# EAGLE design SPI_Switch (EAGLE 6.5.0)
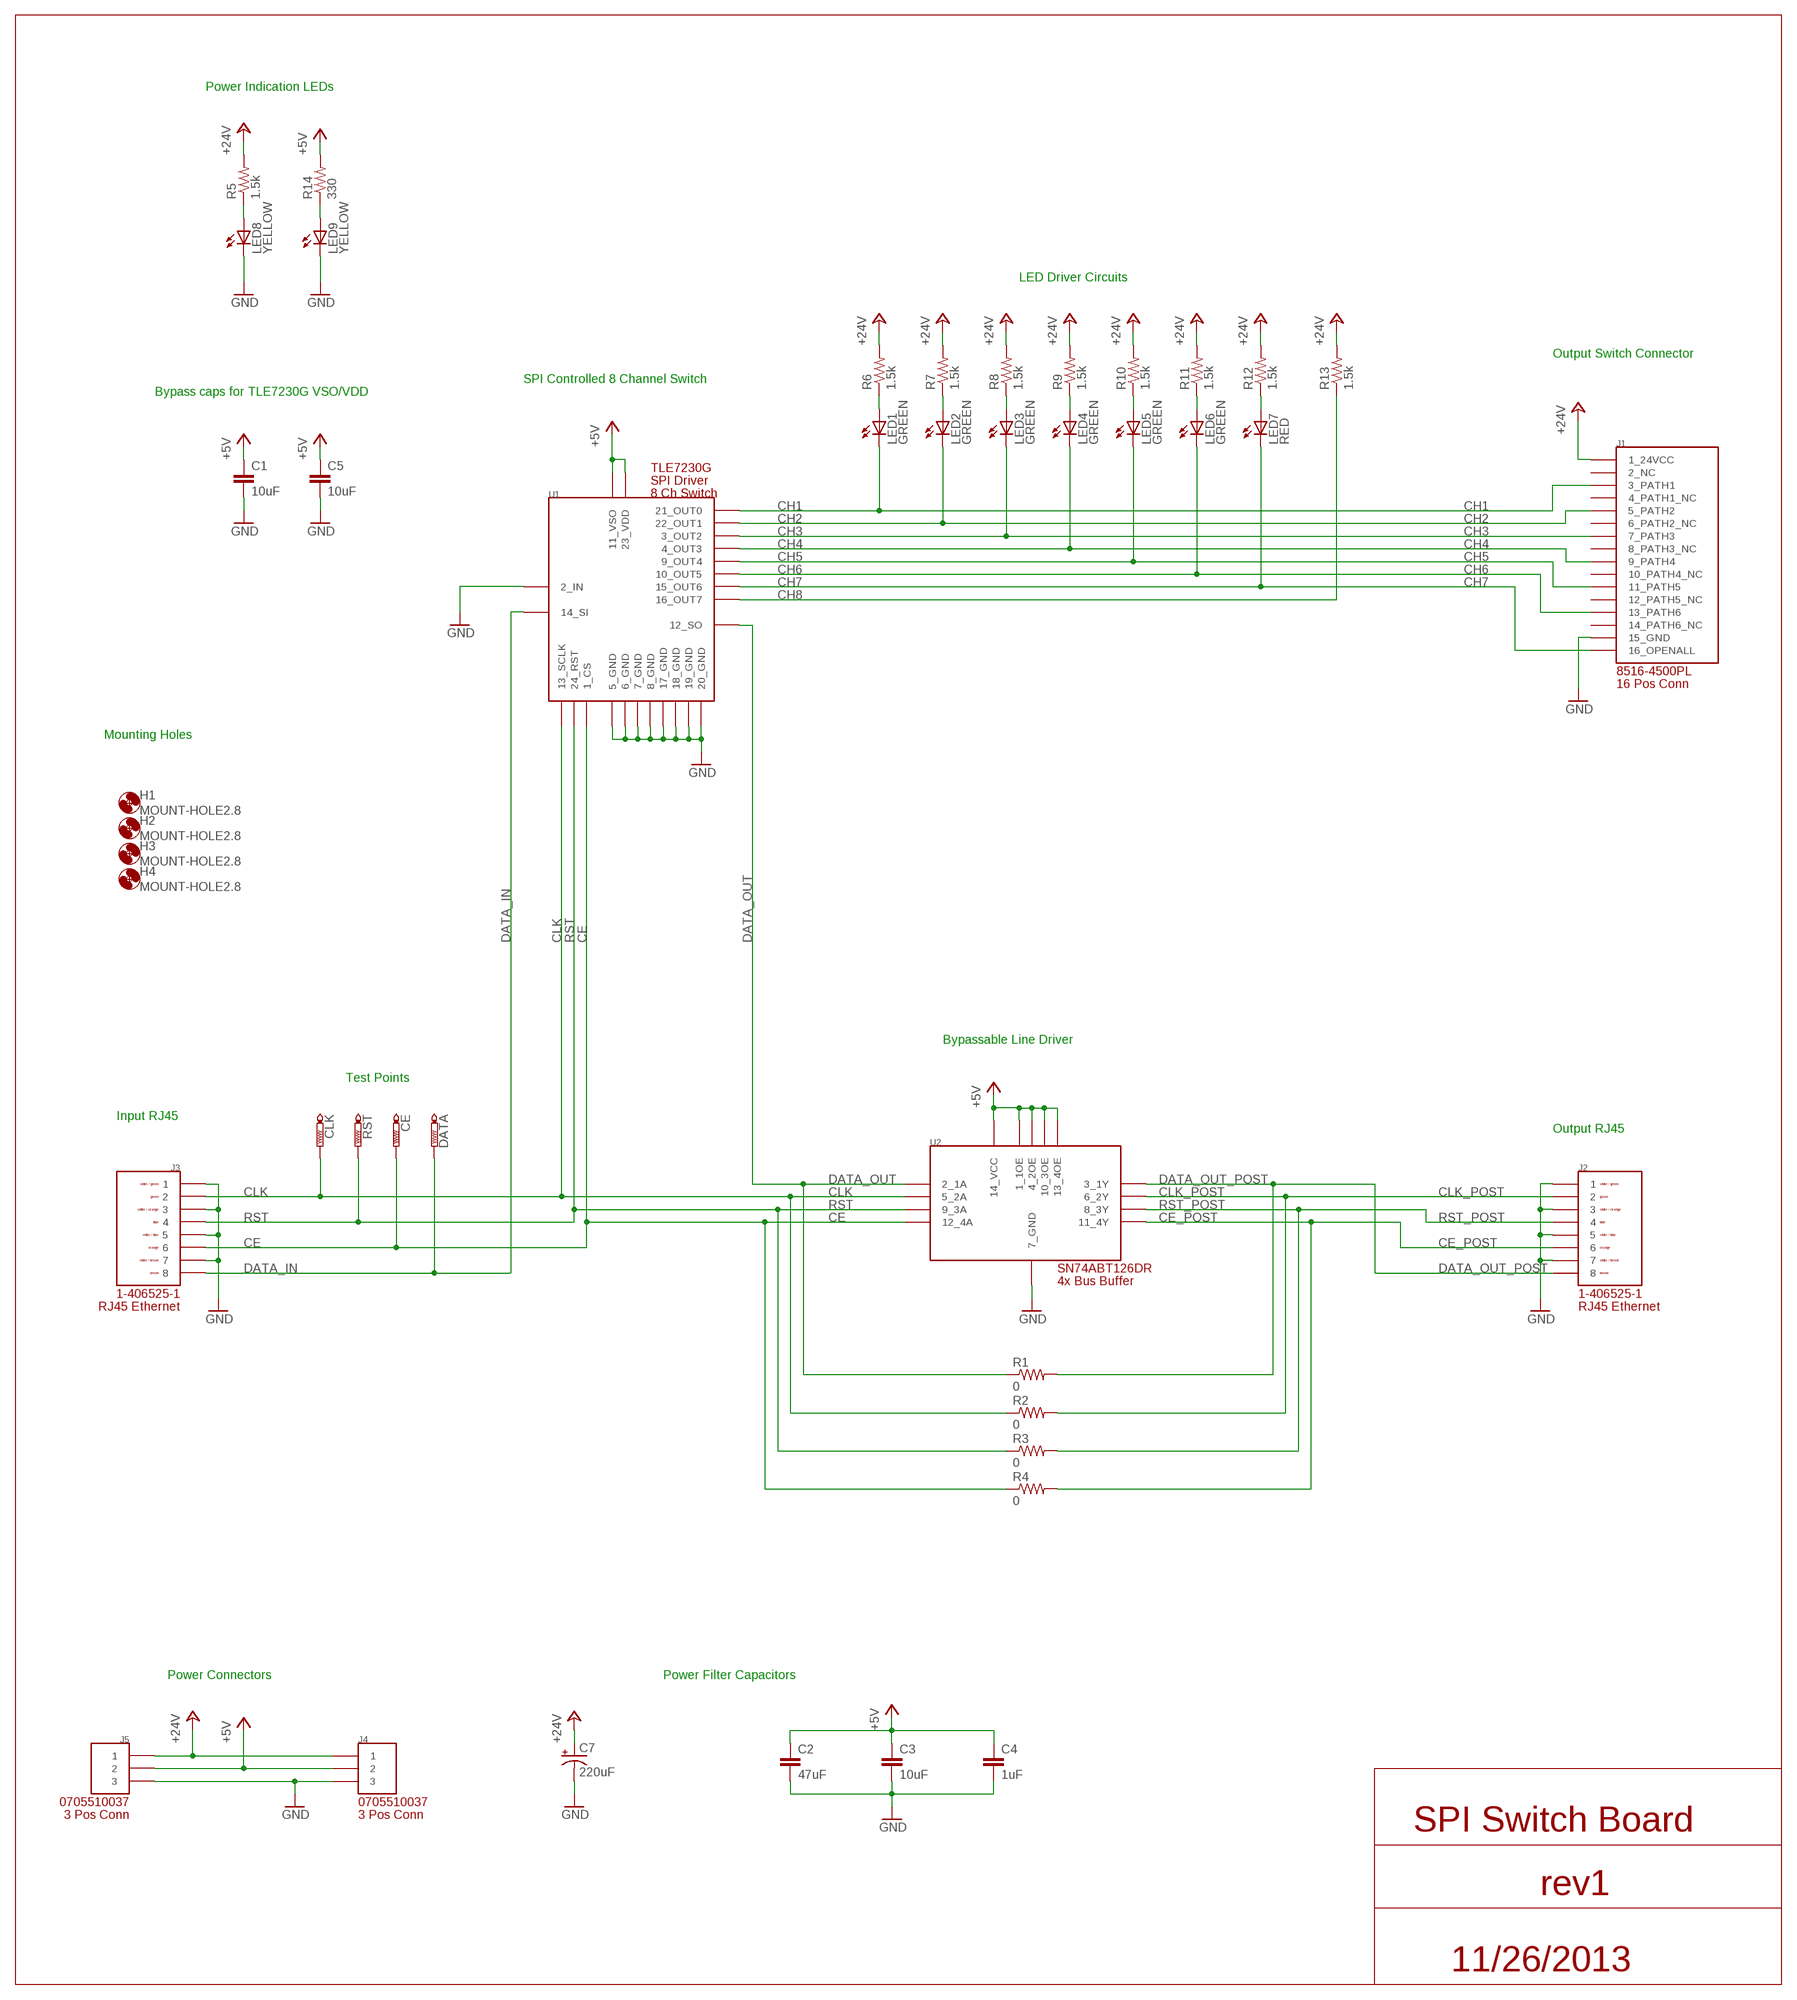
[diagram p0: schematic, sheet 1]

## Parts
C1  10uF  CAP0805  [0805]
C2  47uF  CAP0805  [0805]
C3  10uF  CAP0805  [0805]
C4  1uF  CAP0805  [0805]
C5  10uF  CAP0805  [0805]
C7  220uF  CAP_POLE  [PANASONIC_E]
CE  PTR1PAD1-13  [P1-13]
CLK  PTR1PAD1-13  [P1-13]
DATA  PTR1PAD1-13  [P1-13]
H1  MOUNT-HOLE2.8  [2,8]
H2  MOUNT-HOLE2.8  [2,8]
H3  MOUNT-HOLE2.8  [2,8]
H4  MOUNT-HOLE2.8  [2,8]
J1  8516-4500PL  [8516-4500PL]
J2  1-406525-1  [1-406525-1]
J3  1-406525-1  [1-406525-1]
J4  0705510037  [0705510037]
J5  0705510037  [0705510037]
LED1  GREEN  LED1206  [LED-1206]
LED2  GREEN  LED1206  [LED-1206]
LED3  GREEN  LED1206  [LED-1206]
LED4  GREEN  LED1206  [LED-1206]
LED5  GREEN  LED1206  [LED-1206]
LED6  GREEN  LED1206  [LED-1206]
LED7  RED  LED1206  [LED-1206]
LED8  YELLOW  LED1206  [LED-1206]
LED9  YELLOW  LED1206  [LED-1206]
R1  0  RESISTOR0805-RES  [0805]
R2  0  RESISTOR0805-RES  [0805]
R3  0  RESISTOR0805-RES  [0805]
R4  0  RESISTOR0805-RES  [0805]
R5  1.5k  RESISTOR1206  [1206]
R6  1.5k  RESISTOR1206  [1206]
R7  1.5k  RESISTOR1206  [1206]
R8  1.5k  RESISTOR1206  [1206]
R9  1.5k  RESISTOR1206  [1206]
R10  1.5k  RESISTOR1206  [1206]
R11  1.5k  RESISTOR1206  [1206]
R12  1.5k  RESISTOR1206  [1206]
R13  1.5k  RESISTOR1206  [1206]
R14  330  RESISTOR0805-RES  [0805]
RST  PTR1PAD1-13  [P1-13]
U1  TLE7230G  [TLE7230G]
U2  SN74ABT126  [SN74ABT126]

## Nets
+5V: C1.1 C2.1 C3.1 C4.1 C5.1 J4.P$2 J5.P$2 R14.2 U1.11(11_VSO) U1.23(23_VDD) U2.1(1_1OE) U2.4(4_2OE) U2.10(10_3OE) U2.13(13_4OE) U2.14(14_VCC)
+24V: C7.+ J1.P$1(1_24VCC) J4.P$1 J5.P$1 R5.2 R6.2 R7.2 R8.2 R9.2 R10.2 R11.2 R12.2 R13.2
CE: CE.TP J3.P$6 R4.1 U1.1(1_CS) U2.12(12_4A)
CE_POST: J2.P$6 R4.2 U2.11(11_4Y)
CH1: J1.P$3(3_PATH1) LED1.C U1.21(21_OUT0)
CH2: J1.P$5(5_PATH2) LED2.C U1.22(22_OUT1)
CH3: J1.P$7(7_PATH3) LED3.C U1.3(3_OUT2)
CH4: J1.P$9(9_PATH4) LED4.C U1.4(4_OUT3)
CH5: J1.P$11(11_PATH5) LED5.C U1.9(9_OUT4)
CH6: J1.P$13(13_PATH6) LED6.C U1.10(10_OUT5)
CH7: J1.P$16(16_OPENALL) LED7.C U1.15(15_OUT6)
CH8: R13.1 U1.16(16_OUT7)
CLK: CLK.TP J3.P$2 R2.1 U1.13(13_SCLK) U2.5(5_2A)
CLK_POST: J2.P$2 R2.2 U2.6(6_2Y)
DATA_IN: DATA.TP J3.P$8 U1.14(14_SI)
DATA_OUT: R1.1 U1.12(12_SO) U2.2(2_1A)
DATA_OUT_POST: J2.P$8 R1.2 U2.3(3_1Y)
GND: C1.2 C2.2 C3.2 C4.2 C5.2 C7.- J1.P$15(15_GND) J2.P$1 J2.P$3 J2.P$5 J2.P$7 J3.P$1 J3.P$3 J3.P$5 J3.P$7 J4.P$3 J5.P$3 LED8.C LED9.C U1.2(2_IN) U1.5(5_GND) U1.6(6_GND) U1.7(7_GND) U1.8(8_GND) U1.17(17_GND) U1.18(18_GND) U1.19(19_GND) U1.20(20_GND) U2.7(7_GND)
N$1: LED1.A R6.1
N$2: LED8.A R5.1
N$3: LED2.A R7.1
N$4: LED9.A R14.1
N$5: LED3.A R8.1
N$6: LED4.A R9.1
N$7: LED5.A R10.1
N$8: LED6.A R11.1
N$9: LED7.A R12.1
RST: J3.P$4 R3.1 RST.TP U1.24(24_RST) U2.9(9_3A)
RST_POST: J2.P$4 R3.2 U2.8(8_3Y)
Unconnected: J1.P$2(2_NC) J1.P$4(4_PATH1_NC) J1.P$6(6_PATH2_NC) J1.P$8(8_PATH3_NC) J1.P$10(10_PATH4_NC) J1.P$12(12_PATH5_NC) J1.P$14(14_PATH6_NC)

## Notes on the sheet
- Power Indication LEDs
- LED Driver Circuits
- Output Switch Connector
- SPI Controlled 8 Channel Switch
- Bypass caps for TLE7230G VSO/VDD
- Mounting Holes
- Bypassable Line Driver
- Test Points
- Input RJ45
- Output RJ45
- Power Connectors | Power Filter Capacitors
- SPI Switch Board
- rev1
- 11/26/2013

## Library data of the parts
C1-C5 = SparkFun-Passives:CAP: Capacitor Standard 0603 ceramic capacitor, and 0.1" leaded capacitor.
C7 = SparkFun-Passives:CAP_POL: Capacitor Polarized These are standard SMD and PTH capacitors. Normally 10uF, 47uF, and 100uF in electrolytic and tantalum varieties. Always verify the external diameter of the through hole cap, it varies with capacity, voltage, and manufacturer. The EIA devices should be standard.
CE CLK DATA RST = testpad:PTR1: TEST PIN
H1-H4 = holes:MOUNT-HOLE: MOUNTING HOLE with drill center marker
J1 = SPI_Switch:8516-4500PL: 8516-4500PL Polarized Boardmount Socket
J2 J3 = SPI_Switch:1-406525-1: TE Connectivity Ethernet Jack
J4 J5 = SPI_Switch:0705510037: 0705510037 3 Pin Connector
LED1-LED9 = SparkFun-LED:LED: LEDs Standard schematic elements and footprints for 5mm, 3mm, 1206, and 0603 sized LEDs. 5mm - Spark Fun Electronics SKU : COM-00529 (and others)
R1-R14 = SparkFun-Passives:RESISTOR: Resistor Basic schematic elements and footprints for 0603, 1206, and PTH resistors.
U1 = SPI_Switch:TLE7230G: TLE7230G SPI Driver, 8 channel, low side switch
U2 = SPI_Switch:SN74ABT126: SN74ABT126 Line Driver

## Board
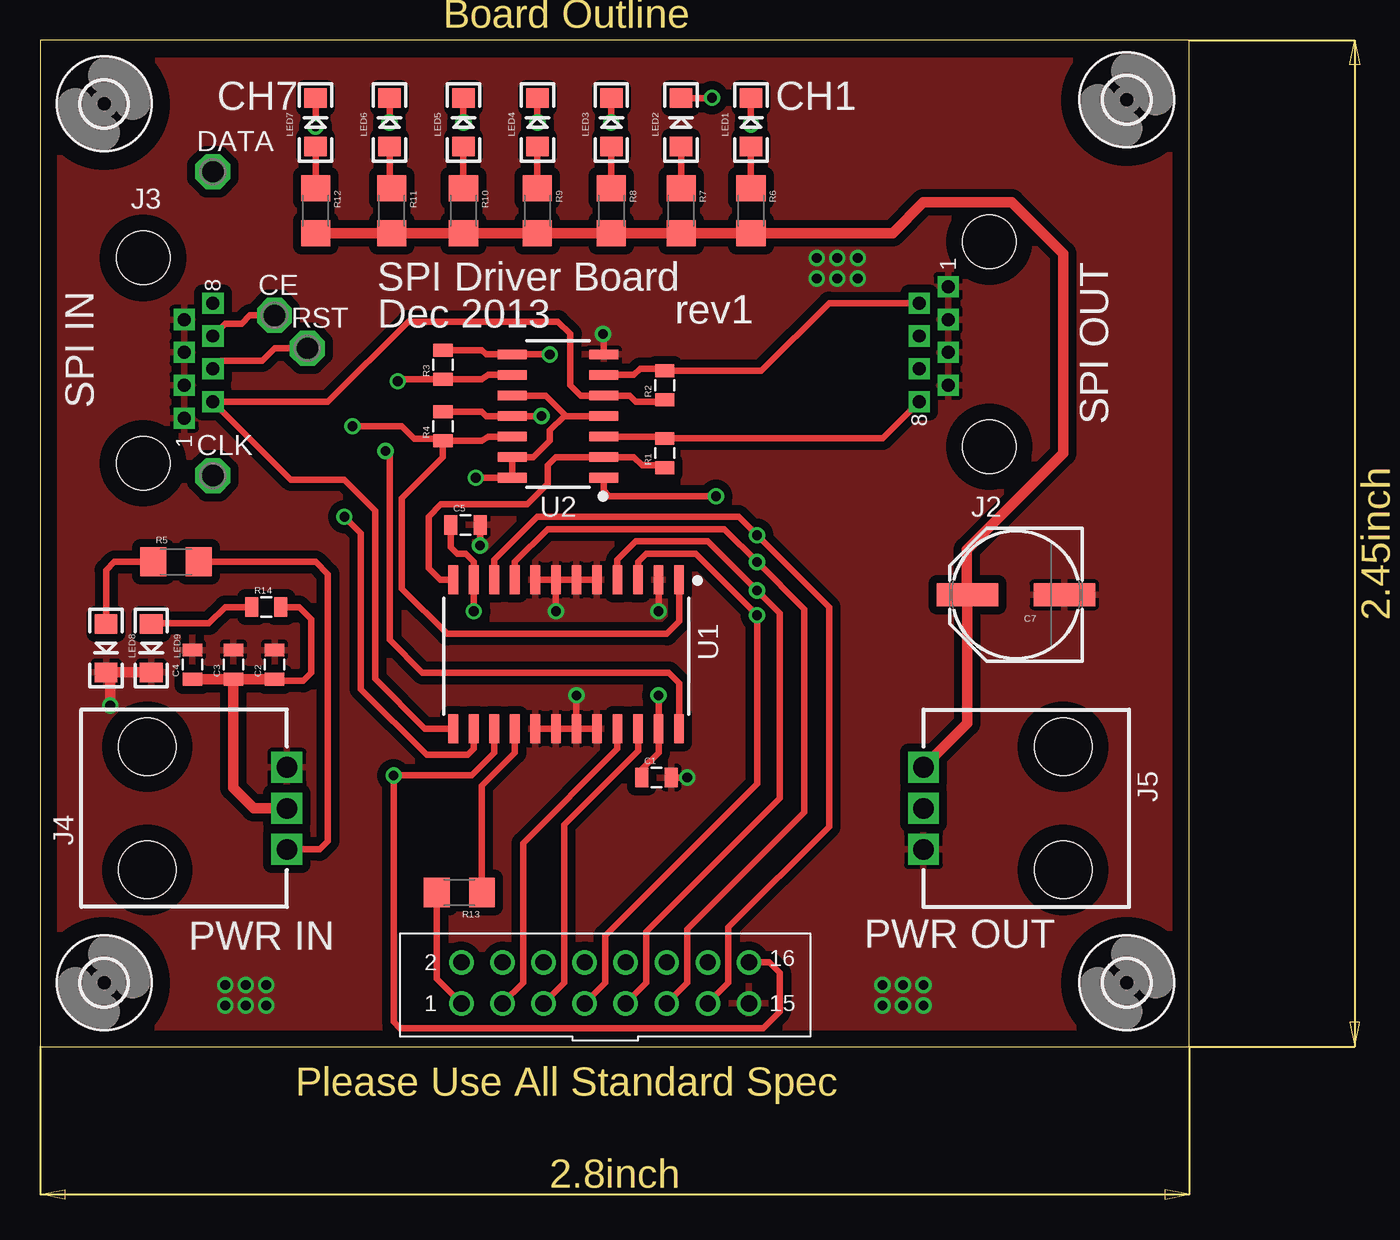
[diagram p1: board, top side]
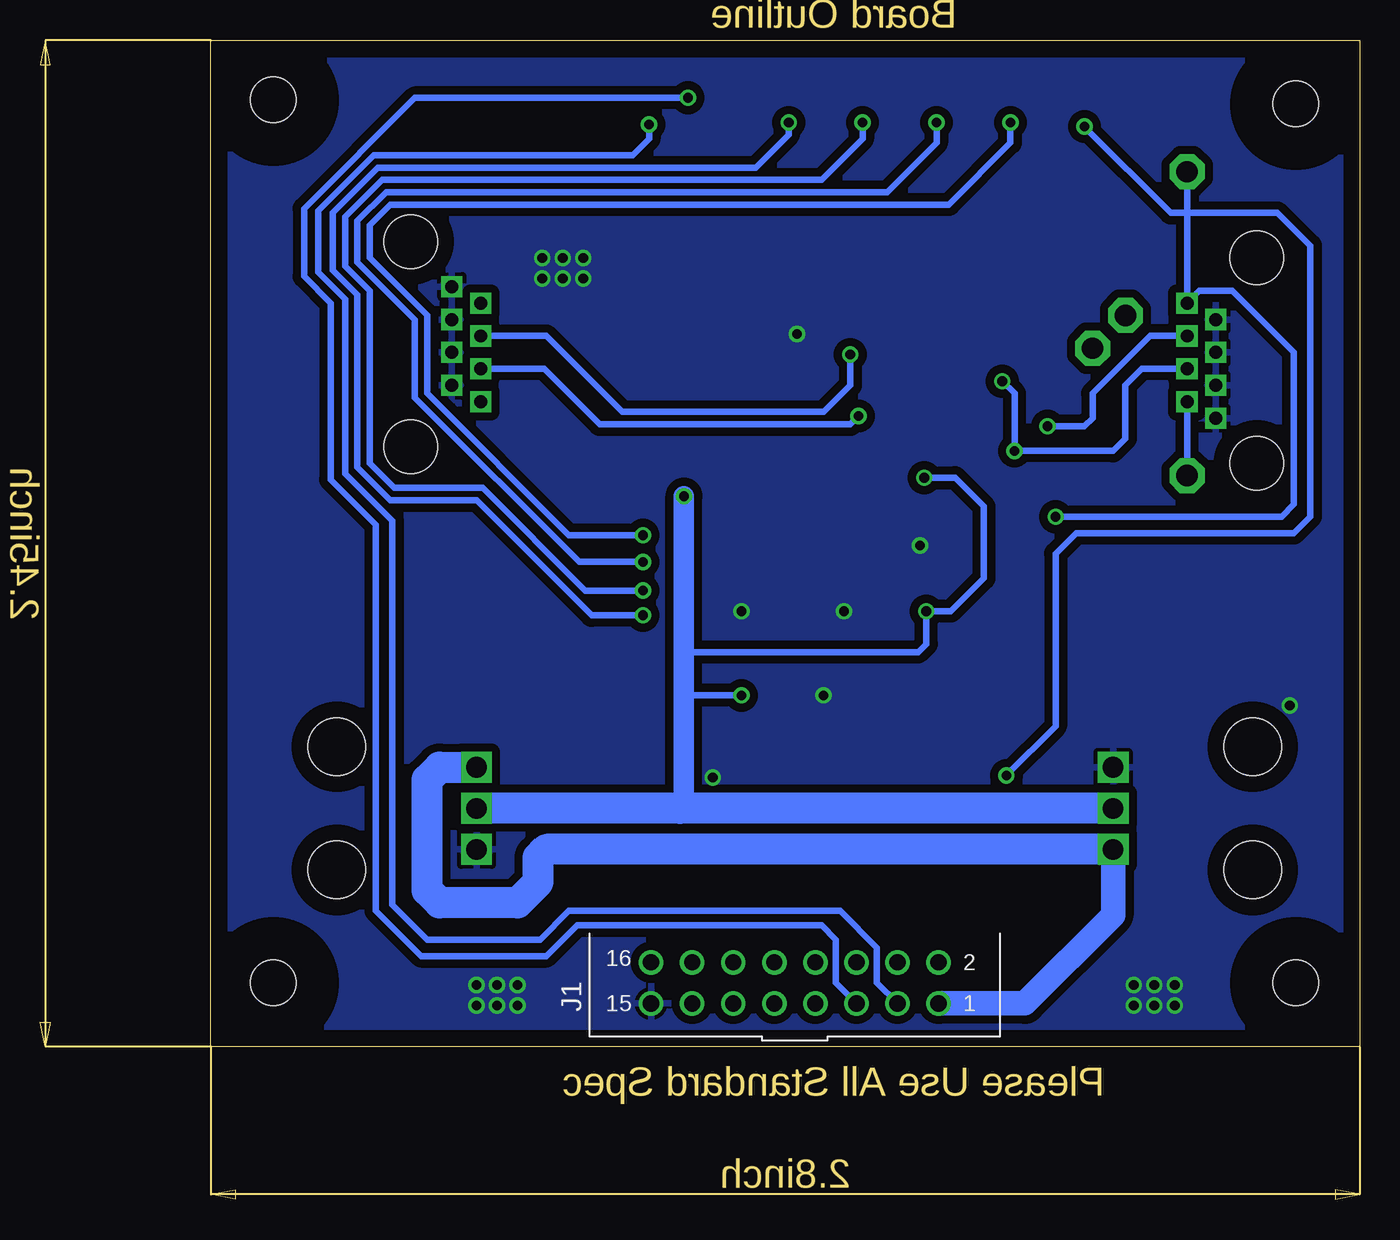
[diagram p2: board, bottom side, seen from below]

Size 71.04 x 62.22 mm. Coordinates in mm from the lower left corner, seen from the top.
Outline: 0,0 71.04,0 71.04,62.22 0,62.22 0,0
Copper layers (1*16): Top 0.035mm / dielectric 1.5mm / Bottom 0.035mm
Design rules "default *": minimum track width 10mil, minimum drill 24mil, track to track 8mil, track to pad 8mil, pad to pad 8mil, via to via 8mil, smd to smd 8mil, copper to edge 40mil, drill to drill 8mil, minimum pad ring 10mil, minimum via ring 8mil, stop-mask expansion 0mil, vias tented up to drill 0mil, thermal gap 10mil

### Footprints (pad centres in the part's own frame; a part is rotated, then mirrored left to right if it is on the bottom)
0805 = smd 0.8 x 1.2: 1 -0.9,0; 2 0.9,0
PANASONIC_E = smd 3.8 x 1.4: + 3,0; - -3,0
P1-13 = drill 1.321 pad 2.159 octagon: TP 0,0
2,8 = hole 2.8: 0,0
8516-4500PL = drill 1.003: P$1 17.78,0; P$2 17.78,2.54; P$3 15.24,0; P$4 15.24,2.54; P$5 12.7,0; P$6 12.7,2.54; P$7 10.16,0; P$8 10.16,2.54; P$9 7.62,0; P$10 7.62,2.54; P$11 5.08,0; P$12 5.08,2.54; P$13 2.54,0; P$14 2.54,2.54; P$15 0,0; P$16 0,2.54
1-406525-1 = drill 0.8 square: P$1 0,0; P$2 -1.016,1.778; P$3 -2.032,0; P$4 -3.048,1.778; P$5 -4.064,0; P$6 -5.08,1.778; P$7 -6.096,0; P$8 -7.112,1.778 | hole 3.302: -9.906,-2.54; 2.794,-2.54
0705510037 = drill 1.27 square: P$1 0,0; P$2 2.54,0; P$3 5.08,0 | hole 3.556: -1.27,8.636; 6.35,8.636
LED-1206 = smd 1.2 x 1.4: A -1.5,0; C 1.5,0
1206 = smd 1.6 x 1.8: 1 -1.4,0; 2 1.4,0
TLE7230G = smd 0.6 x 1.8: 1 3.175,4.29; 2 4.445,4.29; 3 5.715,4.29; 4 6.985,4.29; 5 8.255,4.29; 6 9.525,4.29; 7 10.795,4.29; 8 12.065,4.29; 9 13.335,4.29; 10 14.605,4.29; 11 15.875,4.29; 12 17.145,4.29; 13 17.145,13.49; 14 15.875,13.49; 15 14.605,13.49; 16 13.335,13.49; 17 12.065,13.49; 18 10.795,13.49; 19 9.525,13.49; 20 8.255,13.49; 21 6.985,13.49; 22 5.715,13.49; 23 4.445,13.49; 24 3.175,13.49
SN74ABT126 = smd 0.6 x 1.8: 1 1.143,1.242; 2 2.413,1.242; 3 3.683,1.242; 4 4.953,1.242; 5 6.223,1.242; 6 7.493,1.242; 7 8.763,1.242; 8 8.763,6.886; 9 7.493,6.886; 10 6.223,6.886; 11 4.953,6.886; 12 3.683,6.886; 13 2.413,6.886; 14 1.143,6.886

### Placement (x,y rotation side)
C1  38.1,16.64 0 top
C2  14.48,23.62 90 top
C3  11.94,23.62 90 top
C4  9.4,23.62 90 top
C5  26.29,32.26 0 top
C7  60.33,27.94 180 top
CE  14.48,45.21 0 top
CLK  10.67,35.31 0 top
DATA  10.67,54.1 0 top
H1  67.18,3.94 0 top
H2  3.94,3.94 0 top
H3  3.94,58.29 0 top
H4  67.18,58.55 0 top
J1  43.81,2.67 0 bottom
J2  56.13,46.99 90 top
J3  8.89,38.86 270 top
J4  15.24,12.19 90 top
J5  54.61,17.27 270 top
LED1  43.94,57.15 90 top
LED2  39.62,57.15 90 top
LED3  35.31,57.15 90 top
LED4  30.73,57.15 90 top
LED5  26.16,57.15 90 top
LED6  21.59,57.15 90 top
LED7  17.02,57.15 90 top
LED8  4.06,24.64 270 top
LED9  6.86,24.64 270 top
R1  38.61,36.7 90 top
R2  38.61,40.89 90 top
R3  24.89,42.16 90 top
R4  24.89,38.35 90 top
R5  8.38,29.97 0 top
R6  43.94,51.69 270 top
R7  39.62,51.69 270 top
R8  35.31,51.69 270 top
R9  30.73,51.69 270 top
R10  26.16,51.69 270 top
R11  21.72,51.69 270 top
R12  17.02,51.69 270 top
R13  25.91,9.53 180 top
R14  13.97,27.18 0 top
RST  16.51,43.18 0 top
U1  42.67,33.15 180 top
U2  36.07,34.04 90 top

### Tracks (layer width: path | path; a pad name or v marks a point on that pad's centre or on a via)
+5V  (via drill 0.6)
  Top 0.406: R14.2 16,27.18 16.76,26.42 16.76,23.11 16.26,22.61 14.59,22.61 C2.1 | v26.8,26.92 U1.11 26.8,29.97 26.29,30.48 25.78,30.48 25.39,30.87 C5.1 | v26.92,35.18 U2.14 U2.13 30.48,36.45 31.5,37.47 31.5,38.1 32.38,38.99 | 34.83,35.08 U2.1 34.83,34.39 35.18,34.04 v41.78,34.04 | U2.10 31.24,40.26 32.45,39.05 | 32.45,39.05 32.51,38.99 | v38.23,21.72 U1.23 38.23,18.16 37.2,17.13 C1.1 | U2.4 32.38,38.99 | 32.38,38.99 32.45,39.05
  Top 0.635: C4.1 C3.1 | C3.1 C2.1 | J4.P$2 13.21,14.73 11.94,16 C3.1
  Bottom 0.406: v38.23,21.72 41.53,21.72 41.78,21.97 | 41.78,24.13 41.53,24.38 27.3,24.38 26.8,24.89 v26.8,26.92 25.27,26.92 23.24,28.96 23.24,33.4 25.02,35.18 v26.92,35.18
  Bottom 1.27: 42.04,14.73 41.78,14.99 41.78,21.97 41.78,24.13 v41.78,34.04
  Bottom 1.905: J4.P$2 42.04,14.73 J5.P$2
+24V
  Top 0.406: J4.P$1 17.27,12.19 17.78,12.7 17.78,29.21 17.02,29.97 R5.2 | R13.2 24.51,4.19 J1.P$1
  Top 0.635: J5.P$1 57.33,19.99 C7.+ 57.28,27.99 57.28,30.73 63.25,36.7 63.25,49.02 60.07,52.2 54.61,52.2 52.7,50.29 R6.2 R7.2 R8.2 R9.2 R10.2 R11.2 R12.2
  Bottom 1.524: J4.P$1 15.24,8.13 20.7,2.67 J1.P$1
  Bottom 1.905: J4.P$1 50.29,12.19 50.8,11.68 50.8,10.16 52.07,8.89 56.9,8.89 57.66,9.65 57.66,16.51 56.9,17.27 J5.P$1
CE  (via drill 0.6)
  Top 0.406: R4.1 24.89,37.34 | R4.1 27.29,37.45 27.69,37.72 U2.12 | v19.3,38.35 22.35,38.35 23.11,37.59 24.75,37.59 R4.1 | U1.1 39.5,26.29 38.73,25.53 25.15,25.53 22.35,28.32 22.35,33.91 24.89,36.45 R4.1 | CE.TP 12.95,45.21 12.45,44.7 11.43,44.7 J3.P$6
  Bottom 0.406: J3.P$6 12.95,43.94 16.51,40.39 16.51,38.86 17.02,38.35 v19.3,38.35
CE_POST  (via drill 0.6)
  Top 0.406: v30.99,38.99 U2.11 27.56,38.99 27.29,39.25 R4.2
  Bottom 0.406: J2.P$6 50.42,41.91 46.99,38.48 31.5,38.48 v30.99,38.99
CH1  (via drill 0.6)
  Top 0.406: U1.21 35.69,18.41 29.84,12.57 29.84,3.94 J1.P$3 | LED1.C v43.94,57.02
  Bottom 0.406: v43.94,57.02 43.94,56.13 44.96,55.12 60.96,55.12 64.39,51.69 64.39,47.88 62.74,46.23 62.74,35.43 59.82,32.51 59.82,8.76 57.66,6.6 50.67,6.6 48.9,8.38 32.13,8.38 29.84,6.1 29.84,3.94 J1.P$3
CH2  (via drill 0.6)
  Top 0.406: J1.P$5 32.38,3.94 32.38,13.72 36.96,18.29 U1.22 | LED2.C 41.51,58.65 v41.53,58.67
  Bottom 0.406: v41.53,58.67 58.42,58.67 65.28,51.82 65.28,47.62 63.63,45.97 63.63,35.05 60.83,32.26 60.83,8.38 58.04,5.59 50.29,5.59 48.39,7.49 33.27,7.49 32.38,6.6 32.38,3.94 J1.P$5
CH3  (via drill 0.6)
  Top 0.406: LED3.C v35.31,57.15 | U1.3 36.96,29.97 37.47,30.48 40.51,30.48 v44.32,26.67 44.32,16.26 34.92,6.86 34.92,3.94 J1.P$7
  Bottom 0.406: v35.31,57.15 35.31,56.39 37.34,54.36 60.71,54.36 63.5,51.56 63.5,48.01 61.98,46.48 61.98,35.81 59.94,33.78 54.61,33.78 47.5,26.67 v44.32,26.67
CH4  (via drill 0.6)
  Top 0.406: LED4.C v30.73,57.15 | U1.4 35.69,30.1 36.83,31.24 41.27,31.24 v44.32,28.19 45.72,26.8 45.72,15.37 37.47,7.11 37.47,3.94 J1.P$9
  Bottom 0.406: v30.73,57.15 30.73,56.13 33.27,53.59 60.45,53.59 62.74,51.31 62.74,48.26 61.21,46.74 61.21,36.07 59.69,34.54 54.23,34.54 47.88,28.19 v44.32,28.19
CH5  (via drill 0.6)
  Top 0.406: LED5.C v26.16,57.15 | U1.9 29.34,29.97 31.37,32 42.29,32 v44.32,29.97 47.24,27.05 47.24,14.48 40.01,7.24 40.01,3.94 J1.P$11
  Bottom 0.406: v26.16,57.15 26.16,55.88 29.21,52.83 60.2,52.83 61.98,51.05 61.98,48.51 58.42,44.96 58.42,40.13 48.26,29.97 v44.32,29.97
CH6  (via drill 0.6)
  Top 0.406: LED6.C v21.59,57.15 | U1.10 28.07,30.1 30.73,32.77 43.18,32.77 v44.32,31.62 48.77,27.18 48.77,13.59 42.55,7.37 42.55,3.94 J1.P$13
  Bottom 0.406: v21.59,57.15 21.59,55.88 25.4,52.07 59.94,52.07 61.21,50.8 61.21,48.77 57.66,45.21 57.66,40.39 48.9,31.62 v44.32,31.62
CH7  (via drill 0.6)
  Top 0.406: LED7.C v17.02,56.9 | U1.15 28.07,18.16 26.67,16.76 v21.84,16.76 21.84,1.52 22.23,1.14 44.7,1.14 45.72,2.16 45.72,4.57 45.09,5.21 J1.P$16
  Bottom 0.406: v17.02,56.9 11.68,51.56 5.08,51.56 3.05,49.53 3.05,32.77 4.06,31.75 17.53,31.75 18.8,30.48 18.8,19.81 v21.84,16.76
CH8
  Top 0.406: R13.1 27.31,16.13 29.34,18.16 U1.16
CLK
  Top 0.406: R2.1 38.49,39.88 36.83,39.88 36.45,40.26 U2.5 33.4,40.26 32.77,40.89 32.77,44.07 32,44.83 22.73,44.83 17.78,39.88 J3.P$2 15.49,35.05 18.8,35.05 20.7,33.15 20.7,22.73 23.78,19.66 U1.13
  Bottom 0.406: CLK.TP J3.P$2
CLK_POST
  Top 0.406: U2.6 36.7,41.53 37.08,41.91 38.49,41.91 R2.2 44.59,41.79 48.77,45.97 J2.P$2
DATA_IN  (via drill 0.6)
  Top 0.406: v18.8,32.77 19.81,31.75 19.81,22.1 23.88,18.03 26.42,18.03 26.8,18.41 U1.14
  Bottom 0.406: DATA.TP J3.P$8 9.91,46.74 7.87,46.74 4.06,42.93 4.06,33.53 4.83,32.77 v18.8,32.77
DATA_OUT
  Top 0.406: R1.1 38.47,35.94 37.21,35.94 36.7,36.45 U2.2 31.88,36.45 31.37,35.94 31.37,34.8 30.1,33.53 24.77,33.53 24,32.77 24,29.59 24.74,28.86 U1.12
DATA_OUT_POST
  Top 0.406: U2.3 38.49,37.72 R1.2 52.08,37.6 J2.P$8
GND  (via drill 0.6)
  Top 0.406: LED8.C 4.29,23.14 4.32,23.11 | U1.8 U1.7 | U1.7 v31.88,26.92 | U1.2 v38.23,26.92 | U1.19 v33.15,21.72 | U2.7 34.83,44.04 v34.8,44.07 | U1.7 U1.6 U1.5 | U1.19 U1.20 | U1.19 U1.18 U1.17 | C5.2 v27.19,31 v27.18,30.99 | C1.2 v40.01,16.64
  Top 0.635: 6.83,23.11 LED9.C LED8.C | 4.32,23.11 v4.32,21.08
  other vias: 52.07,3.81 53.34,3.81 53.34,3.81 54.61,2.54 54.61,3.81 53.34,2.54 52.07,2.54 11.43,3.81 12.7,3.81 12.7,3.81 13.97,2.54 13.97,3.81 12.7,2.54 11.43,2.54 48.01,48.77 49.28,48.77 49.28,48.77 50.55,47.5 50.55,48.77 49.28,47.5 48.01,47.5
  pour Top (isolate 0.508): 0,60.96 69.85,60.96 69.85,0 0,0
  pour Bottom (isolate 0.508): 0,60.96 69.85,60.96 69.85,0 0,0
N$1
  Top 0.406: LED1.A R6.1
N$2
  Top 0.406: LED8.A 4.06,29.46 4.57,29.97 R5.1
N$3
  Top 0.406: LED2.A R7.1
N$4
  Top 0.406: R14.1 11.43,27.18 10.41,26.16 6.88,26.16 LED9.A
N$5
  Top 0.406: LED3.A R8.1
N$6
  Top 0.406: LED4.A R9.1
N$7
  Top 0.406: 26.16,55.88 26.67,55.88 26.67,55.65 LED5.A R10.1
N$8
  Top 0.406: LED6.A 21.59,53.22 R11.1
N$9
  Top 0.406: LED7.A R12.1
RST  (via drill 0.6)
  Top 0.406: U2.9 27.69,41.53 27.29,41.26 R3.1 22.21,41.26 v22.1,41.15 | v21.34,36.83 21.59,36.58 21.59,25.15 23.62,23.11 38.86,23.11 39.5,22.48 U1.24 | RST.TP 14.48,43.18 13.72,42.42 11.18,42.42 J3.P$4
  Bottom 0.406: J3.P$4 13.46,41.91 14.48,40.89 14.48,37.59 15.24,36.83 v21.34,36.83 21.34,40.39 v22.1,41.15
RST_POST  (via drill 0.6)
  Top 0.406: R3.2 27.29,43.06 27.56,42.8 U2.8 v31.5,42.8
  Bottom 0.406: J2.P$4 50.29,43.94 45.59,39.24 33.15,39.24 31.5,40.89 v31.5,42.8

### Text on the board
Dimension: Board Outline | Please Use All Standard Spec
tNames: CH7 | CH1 | SPI OUT | SPI IN | SPI Driver Board | rev1 | Dec 2013 | PWR IN | PWR OUT